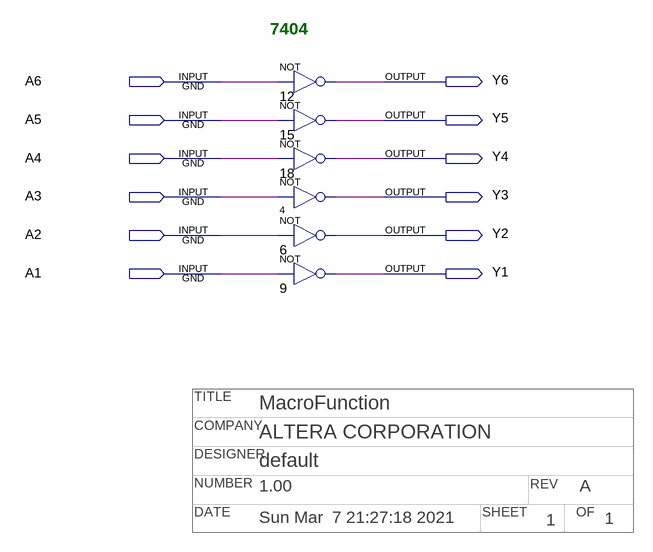
[diagram p0: schematic sheet]
// Quartus schematic DM74LS04.bdf as structural Verilog: 6 symbols, 12 pins
// Title block: TITLE: MacroFunction; COMPANY: ALTERA CORPORATION; DESIGNER: default; NUMBER: 1.00; REV: A; DATE: Sun Mar  7 21:27:18 2021; SHEET: 1; OF: 1
module DM74LS04 (
  input  A6,
  input  A5,
  input  A4,
  input  A3,
  input  A2,
  input  A1,
  output Y6,
  output Y5,
  output Y4,
  output Y3,
  output Y2,
  output Y1
);

  not u_12 (Y6, A6);
  not u_15 (Y5, A5);
  not u_18 (Y4, A4);
  not u_4 (Y3, A3);
  not u_6 (Y2, A2);
  not u_9 (Y1, A1);

  // Notes on the sheet:
  //   7404
endmodule
